# EAGLE design EHDD_LAB_3 (EAGLE 7.7.0)
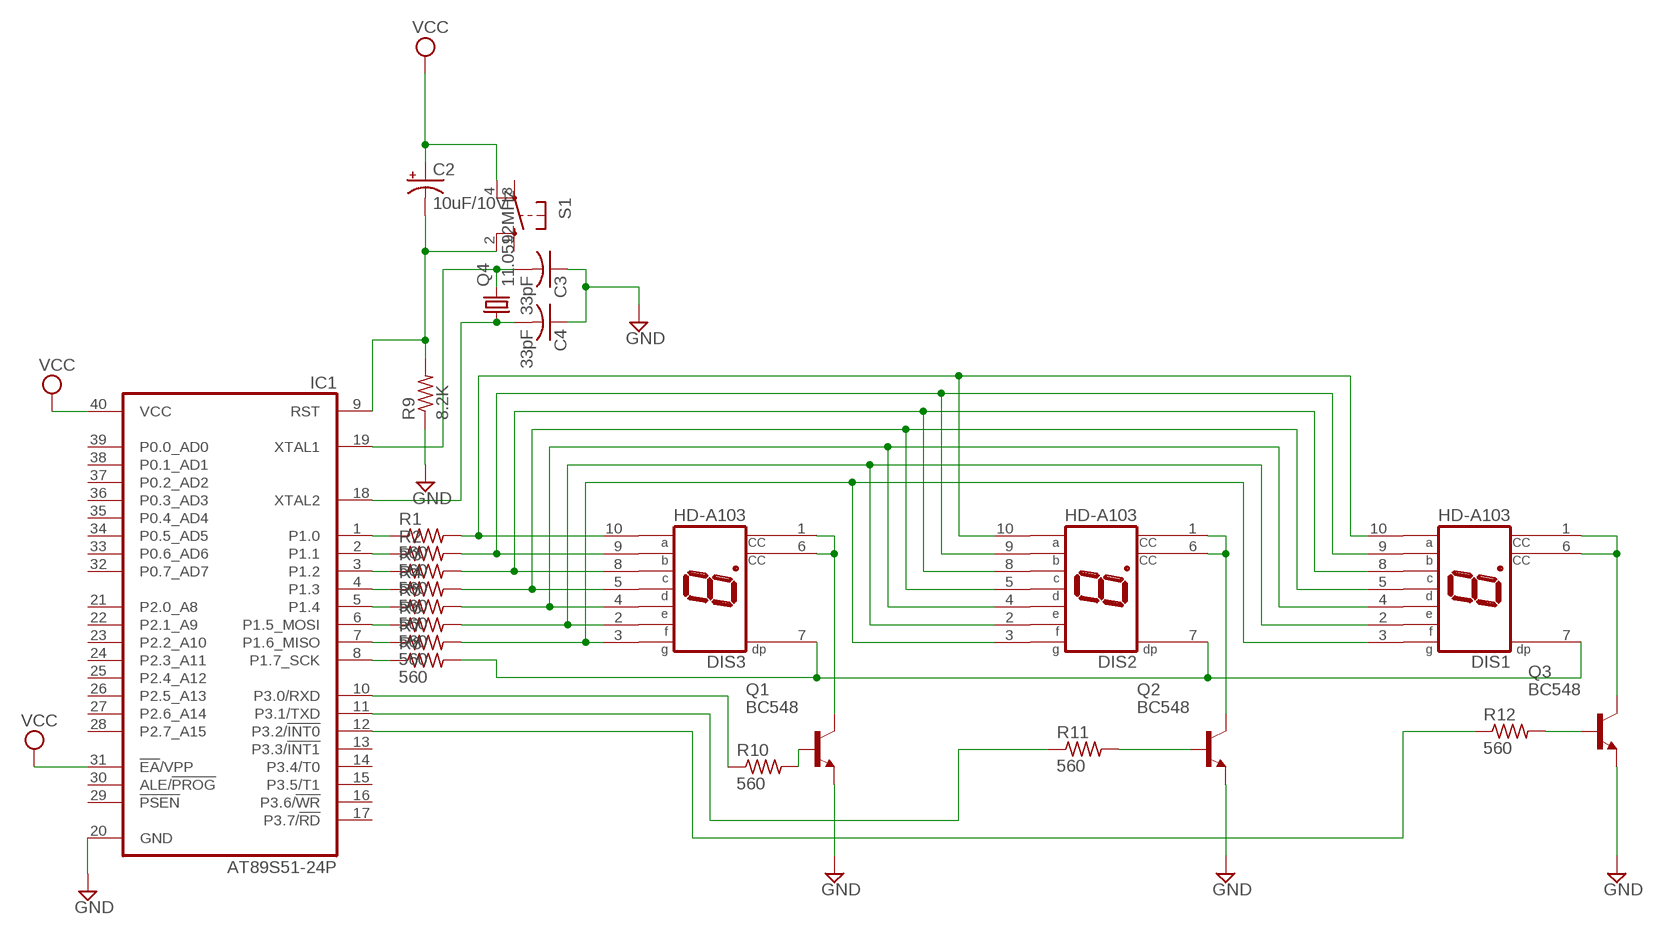
[diagram p0: schematic, sheet 1]

## Parts
C2  10uF/10V  CPOL-USE2-5  [E2-5]
C3  33pF  C-US025-050X050  [C025-050X050]
C4  33pF  C-US025-050X050  [C025-050X050]
DIS1  HD-A103  [HDSP-A]
DIS2  HD-A103  [HDSP-A]
DIS3  HD-A103  [HDSP-A]
IC1  AT89S51-24P  [DIL40]
Q1  BC548  [TO92-EBC]
Q2  BC548  [TO92-EBC]
Q3  BC548  [TO92-EBC]
Q4  11.0592MHz  CRYSTALTC38H  [TC38H]
R1  560  R-US_0207/10  [0207/10]
R2  560  R-US_0207/10  [0207/10]
R3  560  R-US_0207/10  [0207/10]
R4  560  R-US_0207/10  [0207/10]
R5  560  R-US_0207/10  [0207/10]
R6  560  R-US_0207/10  [0207/10]
R7  560  R-US_0207/10  [0207/10]
R8  560  R-US_0207/10  [0207/10]
R9  8.2K  R-US_0207/10  [0207/10]
R10  560  R-US_0207/10  [0207/10]
R11  560  R-US_0207/10  [0207/10]
R12  560  R-US_0207/10  [0207/10]
S1  10-XX  [B3F-10XX]

## Nets
GND: C3.1 C4.1 IC1.20(GND) Q1.E Q2.E Q3.E R9.1
N$1: DIS1.8(C) DIS2.8(C) DIS3.8(C) R3.2
N$2: DIS1.9(B) DIS2.9(B) DIS3.9(B) R2.2
N$3: DIS3.1(CC) DIS3.6(CC) Q1.C
N$4: DIS1.5(D) DIS2.5(D) DIS3.5(D) R4.2
N$5: DIS1.4(E) DIS2.4(E) DIS3.4(E) R5.2
N$6: DIS1.2(F) DIS2.2(F) DIS3.2(F) R6.2
N$7: DIS1.3(G) DIS2.3(G) DIS3.3(G) R7.2
N$8: DIS1.7(DP) DIS2.7(DP) DIS3.7(DP) R8.2
N$9: IC1.1(P1.0) R1.1
N$10: IC1.2(P1.1) R2.1
N$11: IC1.3(P1.2) R3.1
N$12: IC1.4(P1.3) R4.1
N$13: IC1.5(P1.4) R5.1
N$14: IC1.6(P1.5_MOSI) R6.1
N$15: IC1.7(P1.6_MISO) R7.1
N$16: IC1.8(P1.7_SCK) R8.1
N$17: DIS1.10(A) DIS2.10(A) DIS3.10(A) R1.2
N$18: DIS2.1(CC) DIS2.6(CC) Q2.C
N$19: DIS1.1(CC) DIS1.6(CC) Q3.C
N$20: IC1.10(P3.0/RXD) R10.1
N$21: IC1.11(P3.1/TXD) R11.1
N$22: IC1.12(P3.2/!INT0) R12.1
N$23: C2.- IC1.9(RST) R9.2 S1.2(S1)
N$24: Q1.B R10.2
N$25: C3.2 IC1.19(XTAL1) Q4.2
N$26: C4.2 IC1.18(XTAL2) Q4.1
N$27: Q2.B R11.2
N$28: Q3.B R12.2
VCC: C2.+ IC1.31(!EA!/VPP) IC1.40(VCC) S1.4(P1)
Unconnected: IC1.13(P3.3/!INT1) IC1.14(P3.4/T0) IC1.15(P3.5/T1) IC1.16(P3.6/!WR) IC1.17(P3.7/!RD) IC1.21(P2.0_A8) IC1.22(P2.1_A9) IC1.23(P2.2_A10) IC1.24(P2.3_A11) IC1.25(P2.4_A12) IC1.26(P2.5_A13) IC1.27(P2.6_A14) IC1.28(P2.7_A15) IC1.29(!PSEN) IC1.30(ALE/!PROG) IC1.32(P0.7_AD7) IC1.33(P0.6_AD6) IC1.34(P0.5_AD5) IC1.35(P0.4_AD4) IC1.36(P0.3_AD3) IC1.37(P0.2_AD2) IC1.38(P0.1_AD1) IC1.39(P0.0_AD0) S1.1(S) S1.3(P)

## Library data of the parts
C2 = rcl:CPOL-US: POLARIZED CAPACITOR, American symbol
C3 C4 = rcl:C-US: CAPACITOR, American symbol
DIS1-DIS3 = display-hp:HD-A103: LED DISPLAY 1-character 7 segment, decimal point right; OC_FARNELL: unknown; OC_NEWARK: unknown
IC1 = atmel:AT89S51-*: 8-bit Microcontroller with 4K BytesIn-System Programmable Flash Source: http://www.atmel.com/dyn/resources/prod_documents/doc2487.pdf; MPN: AT89S51-24PU; OC_FARNELL: 1095739; OC_NEWARK: 96K6578
Q1-Q3 = transistor-npn:BC548*: NPN Transistor
Q4 = crystal:CRYSTAL: CRYSTAL; OC_FARNELL: unknown; OC_NEWARK: unknown
R1-R12 = rcl:R-US_: RESISTOR, American symbol
S1 = switch-omron:10-XX: OMRON SWITCH; MPN: B3F-1000; OC_FARNELL: 176432; OC_NEWARK: 36M3542

## Board
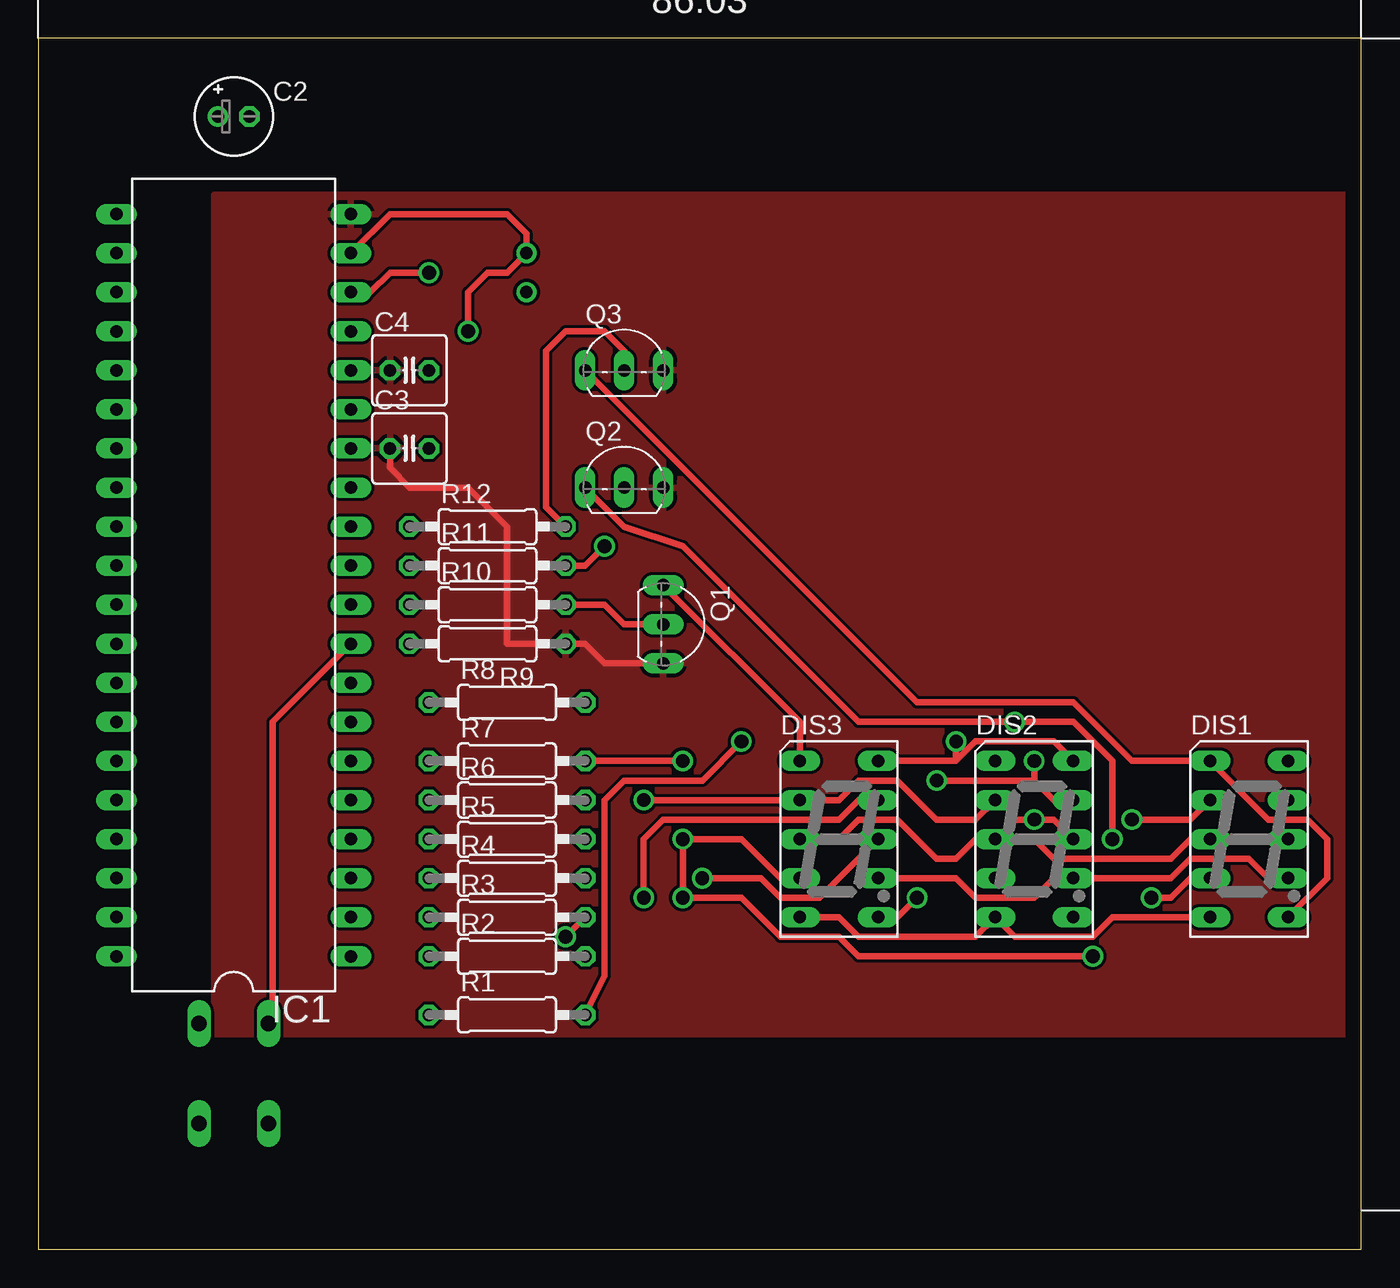
[diagram p1: board, top side]
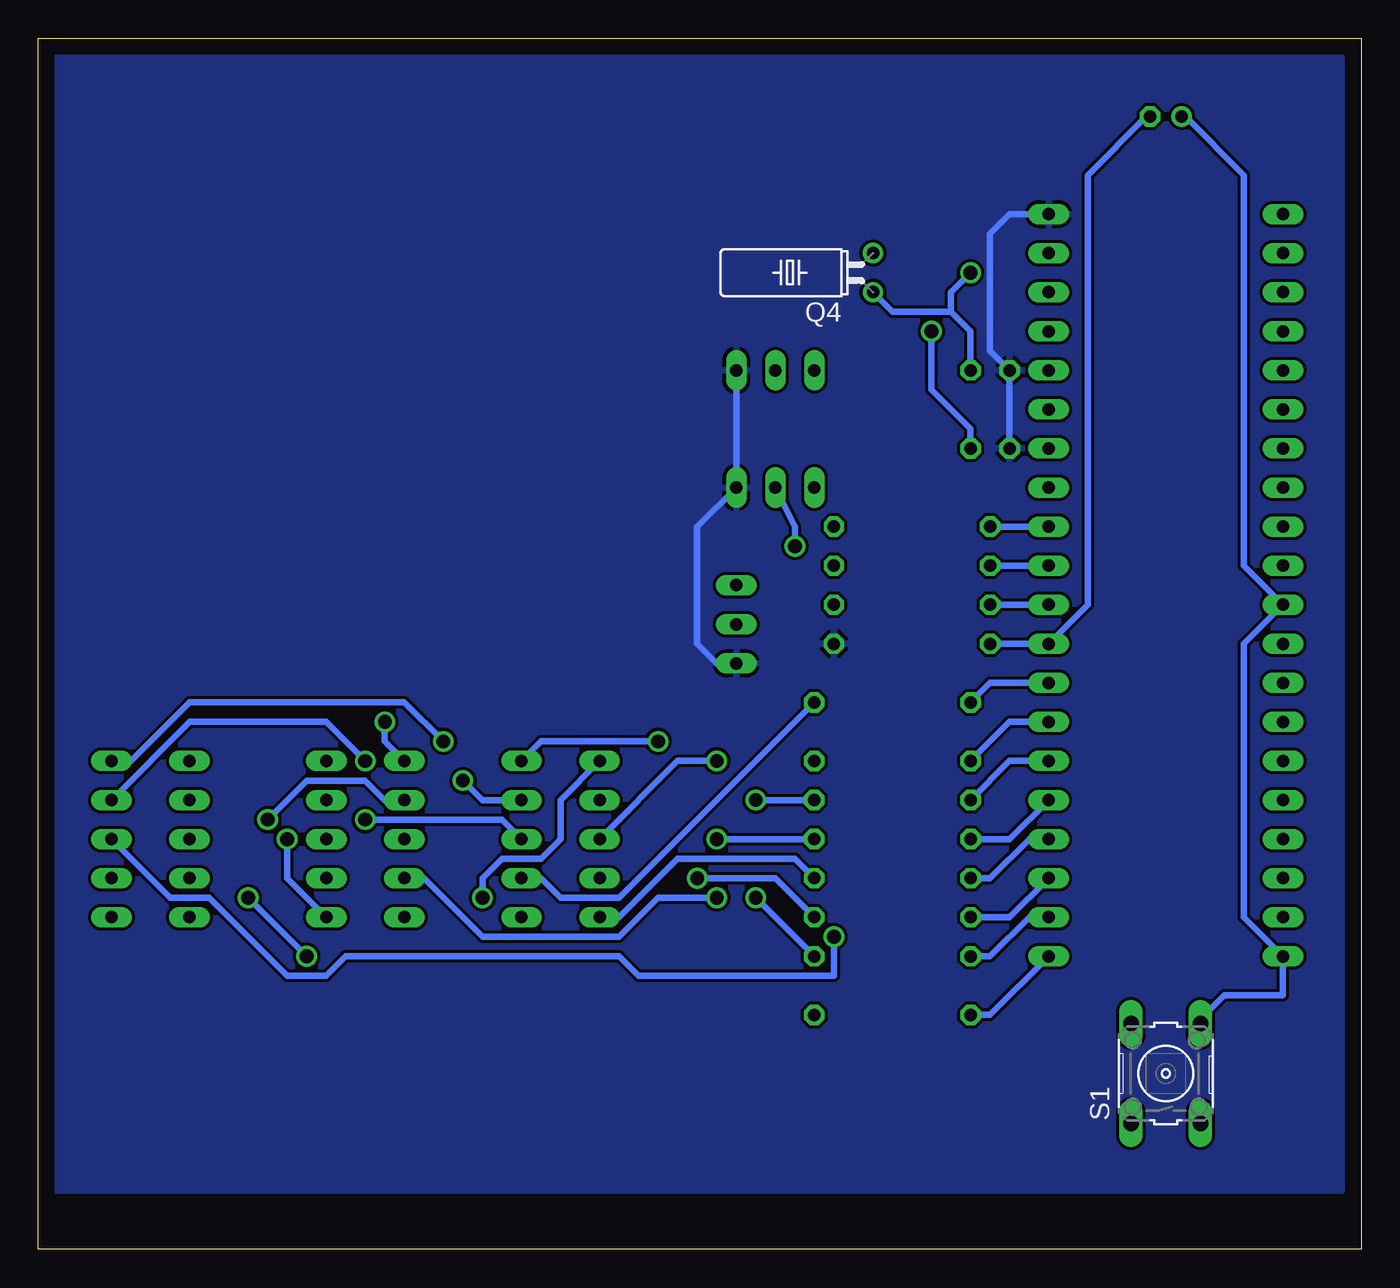
[diagram p2: board, bottom side, seen from below]

Size 86.03 x 78.73 mm. Coordinates in mm from the lower left corner, seen from the top.
Outline: 0,0 86.03,0 86.03,78.73 0,78.73 0,0
Copper layers (1*16): Top 0.035mm / dielectric 1.5mm / Bottom 0.035mm
Design rules "default": minimum track width 10mil, minimum drill 24mil, track to track 8mil, track to pad 8mil, pad to pad 8mil, via to via 8mil, smd to smd 8mil, copper to edge 40mil, drill to drill 8mil, minimum pad ring 10mil, minimum via ring 8mil, stop-mask expansion 4mil, vias tented up to drill 0mil, thermal gap 10mil

### Footprints (pad centres in the part's own frame; a part is rotated, then mirrored left to right if it is on the bottom)
E2-5 = drill 0.813 pad 1.27: + -1.016,0 | drill 0.813 pad 1.27 octagon: - 1.016,0
C025-050X050 = drill 0.813 octagon: 1 -1.27,0; 2 1.27,0
HDSP-A = drill 0.813 long: 1 -2.54,5.08; 2 -2.54,2.54; 3 -2.54,0; 4 -2.54,-2.54; 5 -2.54,-5.08; 6 2.54,-5.08; 7 2.54,-2.54; 8 2.54,0; 9 2.54,2.54; 10 2.54,5.08
DIL40 = drill 0.813 long: 1 -24.13,-7.62; 2 -21.59,-7.62; 3 -19.05,-7.62; 4 -16.51,-7.62; 5 -13.97,-7.62; 6 -11.43,-7.62; 7 -8.89,-7.62; 8 -6.35,-7.62; 9 -3.81,-7.62; 10 -1.27,-7.62; 11 1.27,-7.62; 12 3.81,-7.62; 13 6.35,-7.62; 14 8.89,-7.62; 15 11.43,-7.62; 16 13.97,-7.62; 17 16.51,-7.62; 18 19.05,-7.62; 19 21.59,-7.62; 20 24.13,-7.62; 21 24.13,7.62; 22 21.59,7.62; 23 19.05,7.62; 24 16.51,7.62; 25 13.97,7.62; 26 11.43,7.62; 27 8.89,7.62; 28 6.35,7.62; 29 3.81,7.62; 30 1.27,7.62; 31 -1.27,7.62; 32 -3.81,7.62; 33 -6.35,7.62; 34 -8.89,7.62; 35 -11.43,7.62; 36 -13.97,7.62; 37 -16.51,7.62; 38 -19.05,7.62; 39 -21.59,7.62; 40 -24.13,7.62
TO92-EBC = drill 0.813 long: B 0,-1.27; C -2.54,-1.27; E 2.54,-1.27
TC38H = drill 0.813: 1 -1.27,0; 2 1.27,0
0207/10 = drill 0.813 octagon: 1 -5.08,0; 2 5.08,0
B3F-10XX = drill 1.016 long: 1 -3.251,2.261; 2 3.251,2.261; 3 -3.251,-2.261; 4 3.251,-2.261

### Placement (x,y rotation side)
C2  12.7,73.66 0 top
C3  24.13,52.07 0 top
C4  24.13,57.15 0 top
DIS1  78.74,26.67 0 top
DIS2  64.77,26.67 0 top
DIS3  52.07,26.67 0 top
IC1  12.7,43.18 90 top
Q1  41.91,40.64 270 top
Q2  38.1,50.8 0 top
Q3  38.1,58.42 0 top
Q4  31.75,63.5 90 bottom
R1  30.48,15.24 0 top
R2  30.48,19.05 0 top
R3  30.48,21.59 0 top
R4  30.48,24.13 0 top
R5  30.48,26.67 0 top
R6  30.48,29.21 0 top
R7  30.48,31.75 0 top
R8  30.48,35.56 0 top
R9  29.21,39.37 180 top
R10  29.21,41.91 0 top
R11  29.21,44.45 0 top
R12  29.21,46.99 0 top
S1  12.7,11.43 90 bottom

### Tracks (layer width: path | path; a pad name or v marks a point on that pad's centre or on a via)
GND
  Top 0.406: C3.1 22.86,50.8 24.13,49.53 27.94,49.53 30.48,46.99 30.48,39.37 R9.1 35.56,39.37 36.83,38.1 Q1.E
  Bottom 0.406: IC1.20 22.86,67.31 24.13,66.04 24.13,58.42 C4.1 C3.1 | Q3.E Q2.E 43.18,46.99 43.18,39.37 41.91,38.1 Q1.E
  pour Bottom: 1.27,77.47 1.27,3.81 85.09,3.81 85.09,77.47
  pour Top: 11.43,68.58 85.09,68.58 85.09,13.97 11.43,13.97
N$1  (via drill 0.9)
  Top 0.406: v43.18,24.13 46.99,24.13 48.26,22.86 50.8,22.86 DIS3.8 | DIS2.8 66.04,27.94 v64.77,27.94 63.5,27.94 | v34.29,20.32 R3.2
  Bottom 0.406: R3.2 38.1,24.13 v43.18,24.13 | v64.77,27.94 55.88,27.94 DIS3.8 | v34.29,20.32 34.29,17.78 46.99,17.78 48.26,19.05 66.04,19.05 67.31,17.78 69.85,17.78 74.93,22.86 77.47,22.86 DIS1.8
N$2  (via drill 0.9)
  Top 0.406: v39.37,22.86 39.37,26.67 40.64,27.94 52.07,27.94 53.34,29.21 DIS3.9 | 64.77,30.48 v58.42,30.48 | 64.77,30.48 66.04,29.21 DIS2.9 | v64.77,31.75 64.77,30.48
  Bottom 0.406: v39.37,22.86 R2.2 | v58.42,30.48 57.15,29.21 DIS3.9 | v64.77,31.75 67.31,34.29 76.2,34.29 DIS1.9
N$3  (via drill 0.9)
  Top 0.406: DIS3.6 55.88,21.59 v57.15,22.86 | DIS3.1 49.53,34.29 Q1.C
  Bottom 0.406: v57.15,22.86 57.15,24.13 55.88,25.4 53.34,25.4 52.07,26.67 52.07,29.21 DIS3.1
N$4
  Top 0.406: DIS3.5 52.07,21.59 53.34,20.32 60.96,20.32 DIS2.5 63.5,20.32 68.58,20.32 69.85,21.59 DIS1.5
  Bottom 0.406: R4.2 36.83,25.4 44.45,25.4 48.26,21.59 DIS3.5
N$5  (via drill 0.9)
  Top 0.406: DIS3.4 48.26,24.13 45.72,26.67 v41.91,26.67 v41.91,22.86 45.72,22.86 48.26,20.32 52.07,20.32 53.34,19.05 v68.58,19.05 | v72.39,22.86 73.66,22.86 74.93,24.13 DIS1.4
  Bottom 0.406: R5.2 v41.91,26.67 | v41.91,22.86 45.72,22.86 48.26,20.32 57.15,20.32 60.96,24.13 DIS2.4 | v72.39,22.86 v68.58,19.05
N$6  (via drill 0.9)
  Top 0.406: v39.37,29.21 DIS3.2 52.07,29.21 53.34,30.48 55.88,30.48 58.42,27.94 60.96,27.94 DIS2.2 | v71.12,27.94 74.93,27.94 DIS1.2
  Bottom 0.406: v39.37,29.21 R6.2 | v71.12,27.94 68.58,30.48 64.77,30.48 63.5,29.21 DIS2.2
N$7  (via drill 0.9)
  Top 0.406: R7.2 v41.91,31.75 | DIS3.3 52.07,26.67 53.34,27.94 55.88,27.94 58.42,25.4 59.69,25.4 60.96,26.67 DIS2.3 64.77,26.67 66.04,25.4 73.66,25.4 74.93,26.67 DIS1.3
  Bottom 0.406: v41.91,31.75 44.45,31.75 DIS3.3
N$8
  Top 0.406: DIS3.7 59.69,24.13 60.96,22.86 64.77,22.86 66.04,24.13 DIS2.7 73.66,24.13 74.93,25.4 78.74,25.4 80.01,24.13 DIS1.7
  Bottom 0.406: R8.2 48.26,22.86 52.07,22.86 53.34,24.13 DIS3.7
N$9
  Bottom 0.406: IC1.1 24.13,15.24 R1.1
N$10
  Bottom 0.406: IC1.2 21.59,21.59 24.13,19.05 R2.1
N$11
  Bottom 0.406: IC1.3 22.86,21.59 R3.1
N$12
  Bottom 0.406: IC1.4 21.59,26.67 24.13,24.13 R4.1
N$13
  Bottom 0.406: IC1.5 22.86,26.67 R5.1
N$14
  Bottom 0.406: IC1.6 22.86,31.75 R6.1
N$15
  Bottom 0.406: IC1.7 22.86,34.29 R7.1
N$16
  Bottom 0.406: IC1.8 24.13,36.83 R8.1
N$17  (via drill 0.9)
  Top 0.406: v45.72,33.02 43.18,30.48 38.1,30.48 36.83,29.21 36.83,17.78 R1.2 | DIS3.10 59.69,31.75 | 59.69,31.75 60.96,33.02 66.04,33.02 DIS2.10 | v59.69,33.02 59.69,31.75
  Bottom 0.406: v45.72,33.02 53.34,33.02 DIS3.10 | v59.69,33.02 62.23,35.56 76.2,35.56 80.01,31.75 DIS1.10
N$18  (via drill 0.9)
  Top 0.406: v69.85,26.67 69.85,31.75 67.31,34.29 v63.5,34.29 53.34,34.29 41.91,45.72 38.1,46.99 Q2.C
  Bottom 0.406: v69.85,26.67 69.85,24.13 DIS2.6 | v63.5,34.29 63.5,33.02 DIS2.1
N$19
  Top 0.406: DIS1.6 83.82,24.13 83.82,26.67 82.55,27.94 80.01,27.94 DIS1.1 71.12,31.75 67.31,35.56 57.15,35.56 Q3.C
N$20
  Bottom 0.406: R10.1 IC1.10
N$21
  Bottom 0.406: R11.1 IC1.11
N$22
  Bottom 0.406: IC1.12 R12.1
N$23
  Top 0.406: IC1.9 15.24,34.29 15.24,15.24 S1.2
  Bottom 0.406: R9.2 IC1.9 17.78,41.91 17.78,69.85 13.97,73.66 C2.-
N$24
  Top 0.406: R10.2 36.83,41.91 38.1,40.64 Q1.B
N$25  (via drill 0.9)
  Top 0.406: v27.94,59.69 27.94,62.23 29.21,63.5 30.48,63.5 Q4.2 31.75,66.04 30.48,67.31 22.86,67.31 IC1.19
  Bottom 0.406: C3.2 25.4,53.34 27.94,55.88 v27.94,59.69
N$26  (via drill 0.9)
  Top 0.406: IC1.18 21.59,62.23 22.86,63.5 v25.4,63.5
  Bottom 0.406: C4.2 25.4,59.69 26.67,60.96 | 26.67,60.96 30.48,60.96 Q4.1 | v25.4,63.5 26.67,62.23 26.67,60.96
N$27  (via drill 0.9)
  Top 0.406: R11.2 35.56,44.45 v36.83,45.72
  Bottom 0.406: v36.83,45.72 36.83,46.99 Q2.B
N$28
  Top 0.406: Q3.B 38.1,58.42 36.83,59.69 34.29,59.69 33.02,58.42 33.02,48.26 R12.2
VCC
  Bottom 0.406: C2.+ 11.43,73.66 7.62,69.85 7.62,44.45 IC1.31 7.62,39.37 7.62,21.59 IC1.40 5.08,16.51 8.89,16.51 10.16,15.24 S1.4